# EAGLE design robot_vac (EAGLE 7.3.0)
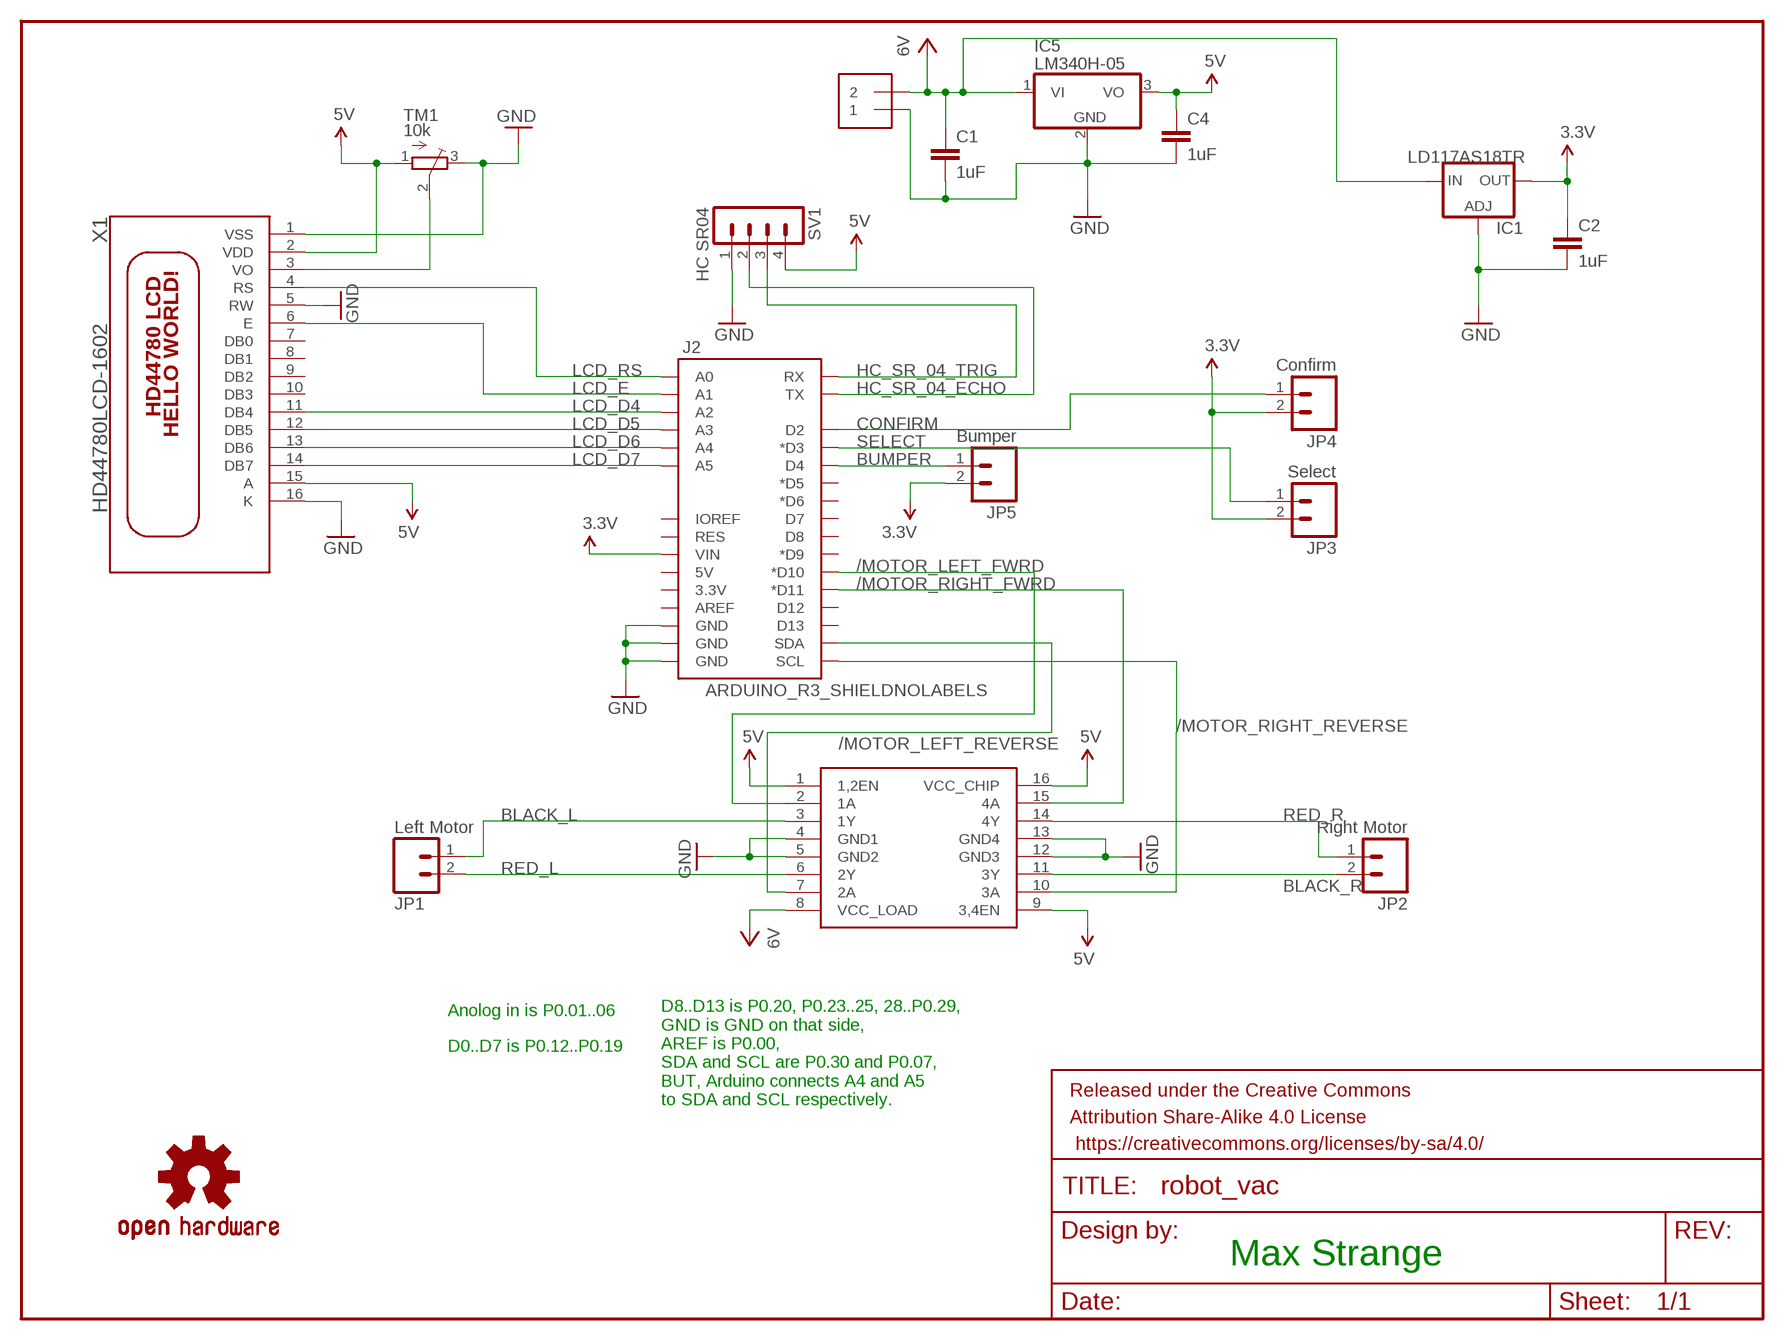
[diagram p0: schematic, sheet 1]

## Parts
C1  1uF  CAPPTH  [CAP-PTH-SMALL]
C2  1uF  CAPPTH  [CAP-PTH-SMALL]
C4  1uF  CAPPTH  [CAP-PTH-SMALL]
FRAME1  FRAME-LETTERNO_PACKAGE  [DUMMY]
H_BRIDGE  SN75441_H_BRIDGE  [DIL16]
IC1  LD117AS18TR  [SOT223]
IC5  LM340H-05  [TO220H]
J1  1X2-3.5MM  [1X2-3.5MM]
J2  ARDUINO_R3_SHIELDNOLABELS  [UNO_R3_SHIELD_NOLABELS]
JP1  Left Motor  M02LOCK  [1X02_LOCK]
JP2  Right Motor  M02LOCK  [1X02_LOCK]
JP3  Select  M02LOCK  [1X02_LOCK]
JP4  Confirm  M02LOCK  [1X02_LOCK]
JP5  Bumper  M02LOCK  [1X02_LOCK]
LOGO1  OSHW-LOGOL  [OSHW-LOGO-L]
SV1  HC SR04  MA04-1  [MA04-1]
TM1  10k  TRIMPOT3386  [TRIM-3386]
X1  HD44780LCD-1602  [LCD1602]

## Nets
3.3V [supply]: C2.1 IC1.4(OUT) J2.VIN JP3.2 JP4.2 JP5.2
5V [supply]: C4.1 H_BRIDGE.1(1,2EN) H_BRIDGE.9(3,4EN) H_BRIDGE.16(VCC_CHIP) IC5.3(VO) SV1.4 TM1.1(A) X1.2(VDD) X1.15(A)
/MOTOR_LEFT_FWRD: H_BRIDGE.2(1A) J2.D10(*D10)
/MOTOR_LEFT_REVERSE: H_BRIDGE.7(2A) J2.SDA
/MOTOR_RIGHT_FWRD: H_BRIDGE.15(4A) J2.D11(*D11)
/MOTOR_RIGHT_REVERSE: H_BRIDGE.10(3A) J2.SCL
BLACK_L: H_BRIDGE.3(1Y) JP1.1
BLACK_R: H_BRIDGE.11(3Y) JP2.2
BUMPER: J2.D4 JP5.1
CONFIRM: J2.D2 JP4.1
GND [supply]: C1.2 C2.2 C4.2 H_BRIDGE.4(GND1) H_BRIDGE.5(GND2) H_BRIDGE.12(GND3) H_BRIDGE.13(GND4) IC1.1(ADJ) IC5.2(GND) J1.1 J2.GND@0(GND) J2.GND@1(GND) J2.GND@2(GND) SV1.1 TM1.3(E) X1.1(VSS) X1.5(RW) X1.16(K)
HC_SR_04_ECHO: J2.TX SV1.2
HC_SR_04_TRIG: J2.RX SV1.3
LCD_D4: J2.A2 X1.11(DB4)
LCD_D5: J2.A3 X1.12(DB5)
LCD_D6: J2.A4 X1.13(DB6)
LCD_D7: J2.A5 X1.14(DB7)
LCD_E: J2.A1 X1.6(E)
LCD_RS: J2.A0 X1.4(RS)
N$4: TM1.2(S) X1.3(VO)
RED_L: H_BRIDGE.6(2Y) JP1.2
RED_R: H_BRIDGE.14(4Y) JP2.1
SELECT: J2.D3(*D3) JP3.1
VCC [supply]: C1.1 H_BRIDGE.8(VCC_LOAD) IC1.3(IN) IC5.1(VI) J1.2 ; supply symbol labelled 6V
Unconnected: J2.3.3V J2.5V J2.AREF J2.D5(*D5) J2.D6(*D6) J2.D7 J2.D8 J2.D9(*D9) J2.D12 J2.D13 J2.IOREF J2.RES X1.7(DB0) X1.8(DB1) X1.9(DB2) X1.10(DB3)

## Notes on the sheet
- Anolog in is P0.01..06
- D0..D7 is P0.12..P0.19
- D8..D13 is P0.20, P0.23..25, 28..P0.29,
  GND is GND on that side,
  AREF is P0.00,
  SDA and SCL are P0.30 and P0.07,
  BUT, Arduino connects A4 and A5
  to SDA and SCL respectively.
- Max Strange

## Library data of the parts
C1 C2 C4 = SparkFun-Capacitors:CAP: Capacitor Standard 0603 ceramic capacitor, and 0.1" leaded capacitor.
FRAME1 = SparkFun-Aesthetics:FRAME-LETTER: Schematic Frame Standard 8.5x11 US Letter frame; DESIGNER: Nobody; VERSION: v01
H_BRIDGE = max parts:SN75441_H_BRIDGE
IC1 = v-reg:LD117A?*: Low drop fixed and adjustable positive voltage regulators 1 A Source: http://www.st.com/stonline/products/literature/ds/7194/ld1117axx.pdf
IC5 = linear:LM340?-*: Positive VOLTAGE REGULATOR Source: http://cache.national.com/ds/LM/LM340.pdf
J1 = adafruit:1X2: 3.5mm Terminal block http://www.ladyada.net/library/pcb/eaglelibrary.html
J2 = SparkFun-Boards:ARDUINO_R3_SHIELD: Shield form compatible with the Arduino Uno R3.
JP1-JP5 = SparkFun-Connectors:M02: Standard 2-pin 0.1" header. Use with - straight break away headers ( PRT-00116) - right angle break away headers (PRT-00553) - swiss pins (PRT-00743) - machine pins (PRT-00117) - female headers (PRT-00115) Molex polarized connector foot print use with: PRT-08233 with associated crimp pins and housings. 2.54_SCREWTERM for use with PRT-10571. 3.5mm Screw Terminal footprints for PRT-08084 5mm Screw Terminal footprints for use with PRT-08432
LOGO1 = SparkFun-Aesthetics:OSHW-LOGO: Open Source Hardware Logo This logo indicates the piece of hardware it is found on incorporates a OSHW license and/or adheres to the definition of open source hardware found here: http://freedomdefined.org/OSHW
SV1 = con-lstb:MA04-1: PIN HEADER; OC_FARNELL: unknown; OC_NEWARK: unknown
TM1 = adafruit:TRIMPOT: SMT trimmer potentiometer part number TC33X http://www.ladyada.net/library/eagle
X1 = max parts:HD44780LCD: HD44780 LCD Standard character type LCDs, available in sizes from 8x1 to 40x4!

## Net classes
0 default: width 0.254 mm, clearance 0.254 mm
1 supply: width 0.508 mm, clearance 0.205 mm to class 0, clearance 0.508 mm

## Board
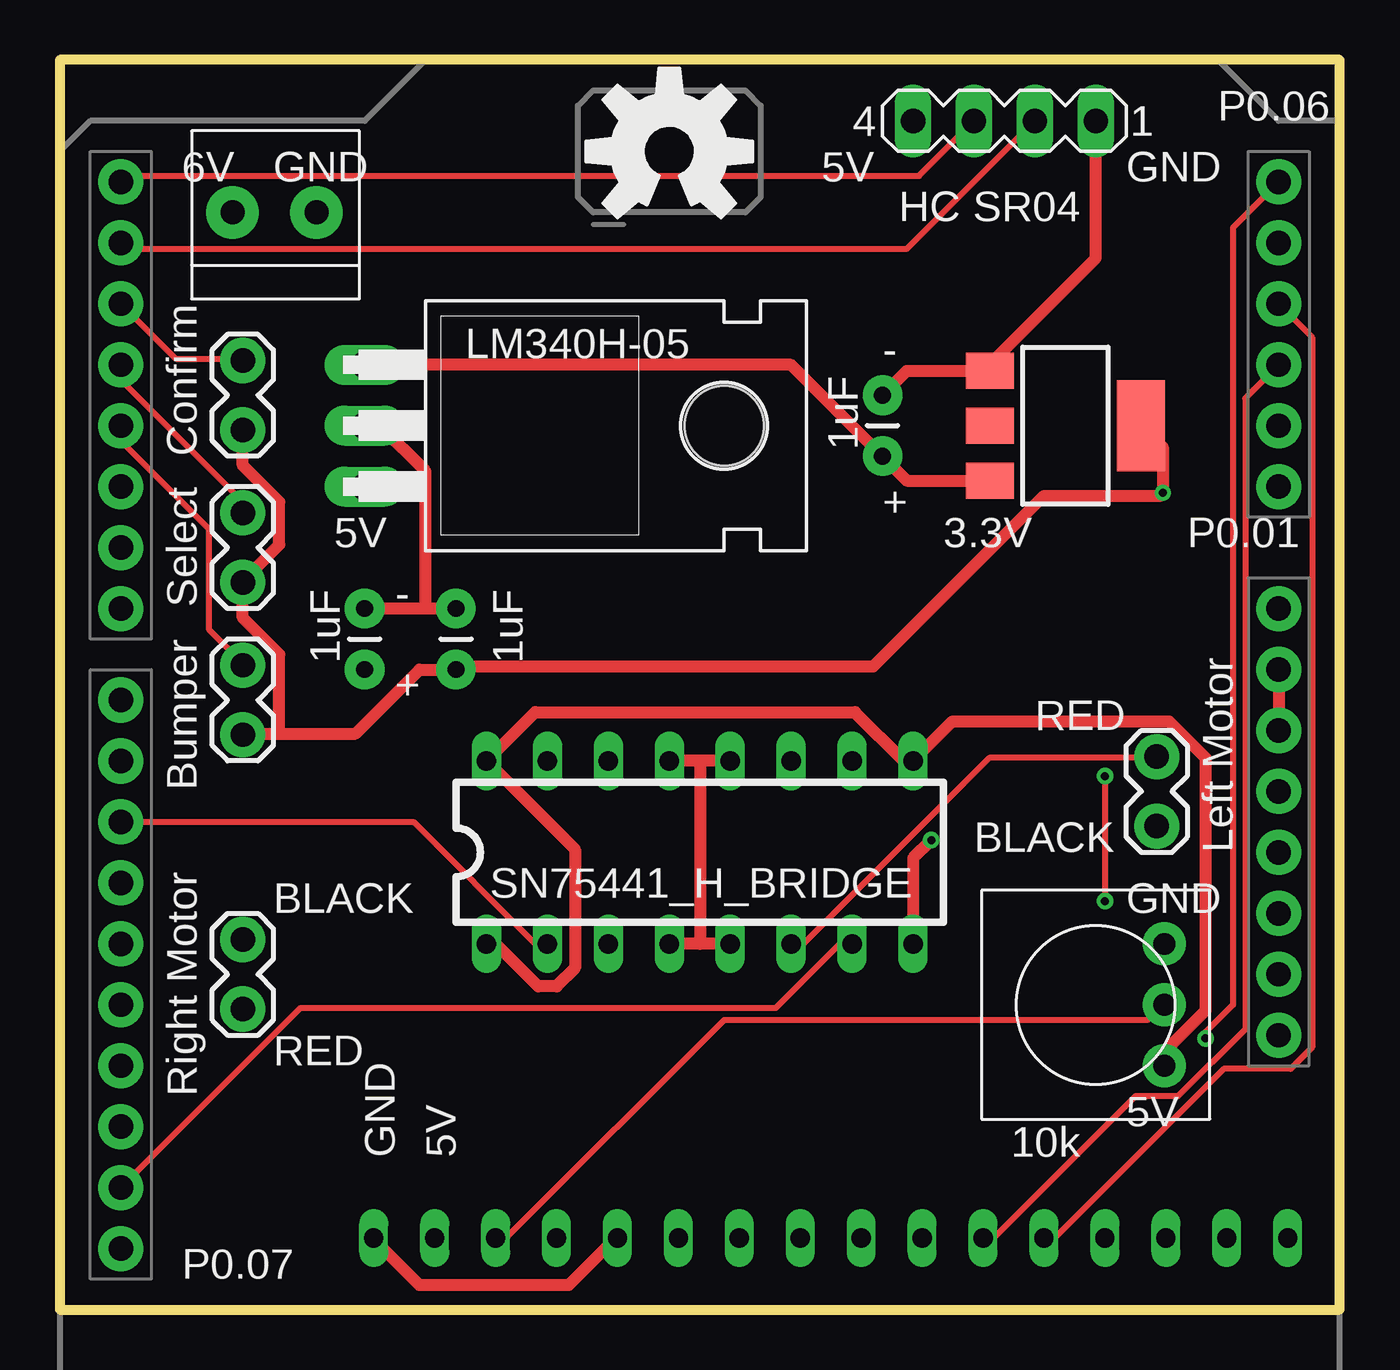
[diagram p1: board, top side]
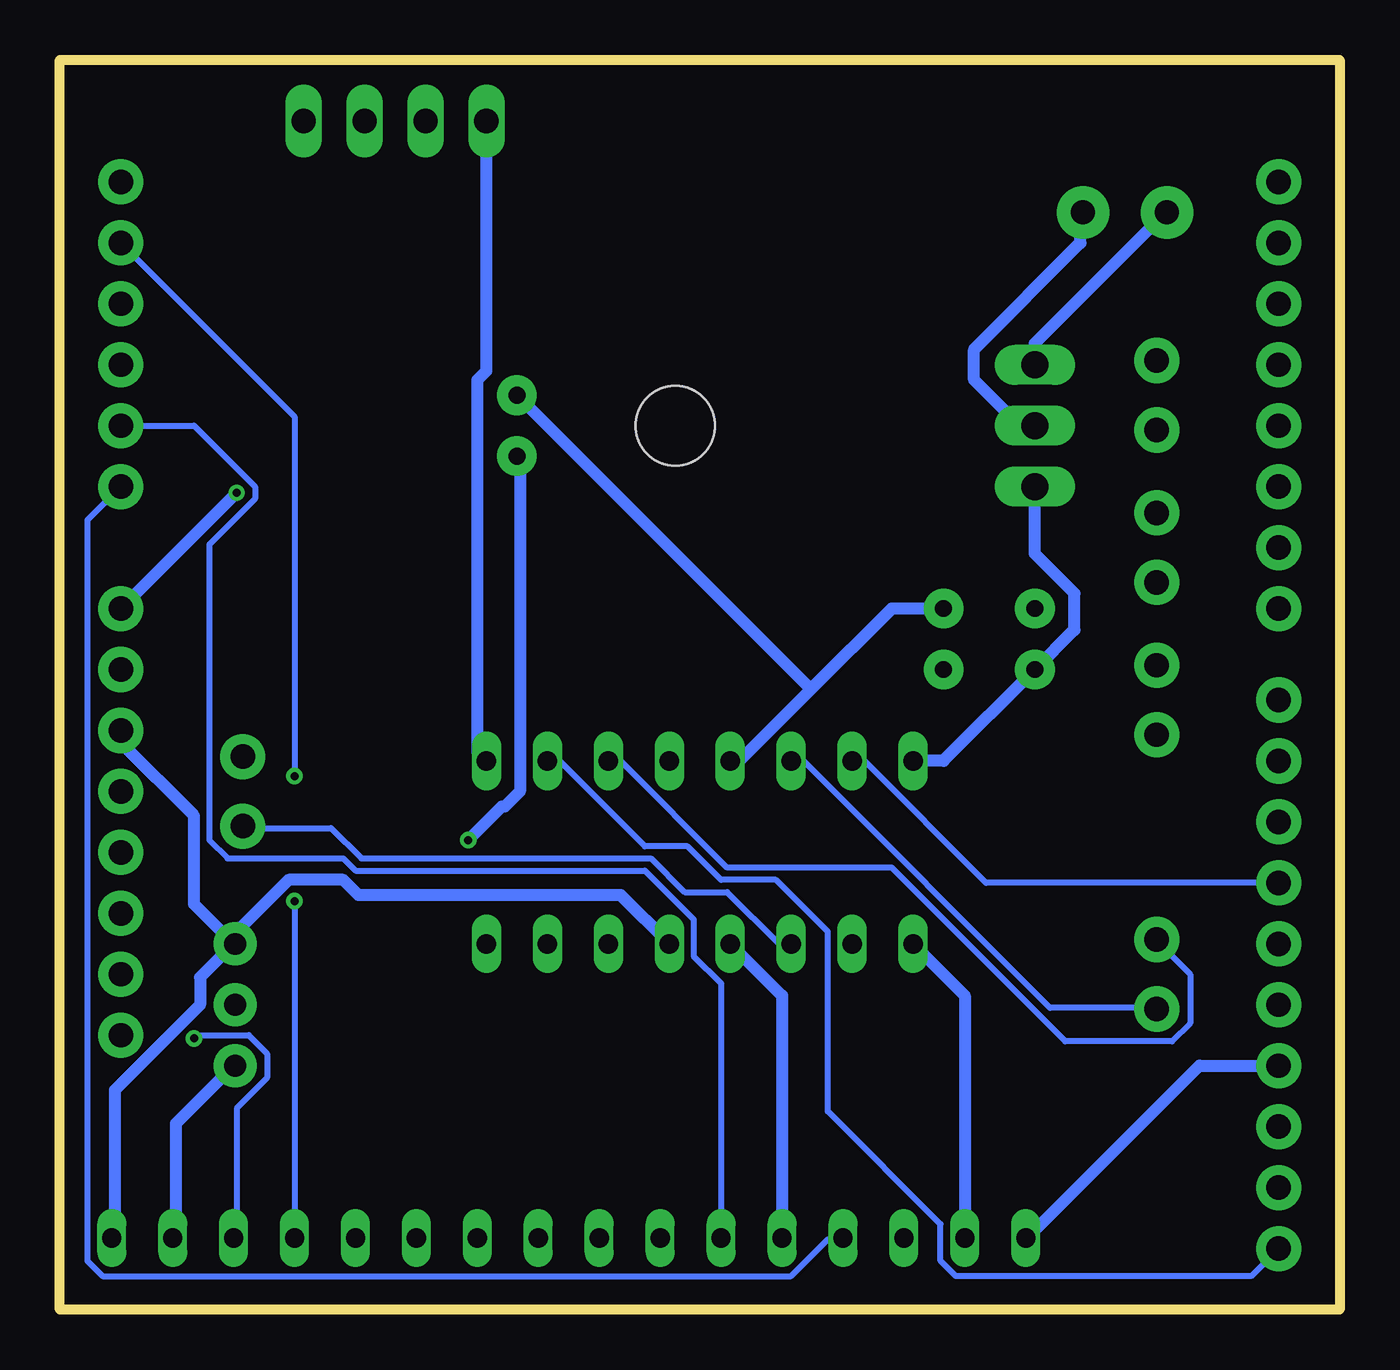
[diagram p2: board, bottom side, seen from below]

Size 53.34 x 52.07 mm. Coordinates in mm from the lower left corner, seen from the top.
Outline: 0,0 53.34,0 53.34,52.07 0,52.07 0,0
Copper layers (1*16): Top 0.0356mm / dielectric 1.5011mm / Bottom 0.0356mm
Design rules "LaenPCBOrder": minimum track width 6mil, minimum drill 13mil, track to track 6mil, track to pad 6mil, pad to pad 6mil, via to via 6mil, smd to smd 6mil, copper to edge 15mil, drill to drill 6mil, minimum pad ring 7mil, minimum via ring 7mil, stop-mask expansion 3mil, vias tented up to drill 0mil, thermal gap 10mil

### Footprints (pad centres in the part's own frame; a part is rotated, then mirrored left to right if it is on the bottom)
CAP-PTH-SMALL = drill 0.7 pad 1.651: 1 0,0; 2 2.54,0
DIL16 = drill 0.813 long: 1 -8.89,-3.81; 2 -6.35,-3.81; 3 -3.81,-3.81; 4 -1.27,-3.81; 5 1.27,-3.81; 6 3.81,-3.81; 7 6.35,-3.81; 8 8.89,-3.81; 9 8.89,3.81; 10 6.35,3.81; 11 3.81,3.81; 12 1.27,3.81; 13 -1.27,3.81; 14 -3.81,3.81; 15 -6.35,3.81; 16 -8.89,3.81
SOT223 = smd 1.5 x 2: 1 -2.3,-3.15; 2 0,-3.15; 3 2.3,-3.15 | smd 3.8 x 2: 4 0,3.15
TO220H = drill 1.118 long: 1 -2.54,-10.16; 2 0,-10.16; 3 2.54,-10.16 | hole 3.302: 0,4.826
1X2-3.5MM = drill 1 pad 2.184: 1 1.8,0; 2 -1.7,0
UNO_R3_SHIELD_NOLABELS = drill 1.016 pad 1.88: 3.3V 50.8,26.67; 5V 50.8,29.21; A0 50.8,41.91; A1 50.8,44.45; A2 50.8,46.99; A3 50.8,49.53; A4 50.8,52.07; A5 50.8,54.61; AREF 2.54,15.24; D2 2.54,49.53; D3 2.54,46.99; D4 2.54,44.45; D5 2.54,41.91; D6 2.54,39.37; D7 2.54,36.83; D8 2.54,33.02; D9 2.54,30.48; D10 2.54,27.94; D11 2.54,25.4; D12 2.54,22.86; D13 2.54,20.32; GND@0 50.8,31.75; GND@1 50.8,34.29; GND@2 2.54,17.78; IOREF 50.8,21.59; NC 50.8,19.05; RES 50.8,24.13; RX 2.54,54.61; SCL 2.54,10.16; SDA 2.54,12.7; TX 2.54,52.07; VIN 50.8,36.83
1X02_LOCK = drill 1.016 pad 1.88: 1 -0.178,0; 2 2.718,0
MA04-1 = drill 1.016 long: 1 -3.81,0; 2 -1.27,0; 3 1.27,0; 4 3.81,0
TRIM-3386 = drill 0.9 pad 1.778: 1 -2.54,-2.857; 2 0,-2.857; 3 2.54,-2.857
LCD1602 = drill 0.8 long: 1 8,2.98; 2 10.54,2.98; 3 13.08,2.98; 4 15.62,2.98; 5 18.16,2.98; 6 20.7,2.98; 7 23.24,2.98; 8 25.78,2.98; 9 28.32,2.98; 10 30.86,2.98; 11 33.4,2.98; 12 35.94,2.98; 13 38.48,2.98; 14 41.02,2.98; 15 43.56,2.98; 16 46.1,2.98

### Placement (x,y rotation side)
C1  34.29,35.56 90 top
C2  16.51,26.67 90 top
C4  12.7,26.67 90 top
FRAME1  -22.86,10.16 0 top  (outside the outline)
H_BRIDGE  26.67,19.05 0 top
IC1  41.91,36.83 270 top
IC5  22.86,36.83 270 top
J1  8.89,45.72 0 top
J2  0,-7.62 0 top
JP1  45.72,20.32 90 top
JP2  7.62,12.7 90 top
JP3  7.62,33.02 270 top
JP4  7.62,39.37 270 top
JP5  7.62,26.67 270 top
LOGO1  25.4,48.26 0 top
SV1  39.37,49.53 180 top
TM1  43.18,12.7 90 top
X1  5.08,0 0 top

### Tracks (layer width: path | path; a pad name or v marks a point on that pad's centre or on a via)
3.3V  (via drill 0.33)
  Top 0.508: IC1.4 45.09,36.83 45.97,35.94 v45.97,34.04 45.85,33.91 41.02,33.91 33.91,26.8 16.64,26.8 C2.1 14.99,26.67 12.32,24 9.14,24 | 9.14,24 7.62,24 JP5.2 | 9.14,24 9.14,27.3 7.62,28.83 JP3.2 7.75,30.48 9.14,31.88 9.14,33.66 7.62,35.18 JP4.2
  Bottom 0.508: v45.97,34.04 J2.VIN
5V
  Top 0.508: TM1.1 46.1,10.16 46.1,10.79 47.75,12.45 47.75,22.99 46.23,24.51 37.21,24.51 H_BRIDGE.9 35.18,22.86 33.15,24.89 19.81,24.89 H_BRIDGE.16 21.46,19.18 21.46,14.22 20.7,13.46 19.94,13.46 18.16,15.24 H_BRIDGE.1
  Bottom 0.508: H_BRIDGE.1 15.62,13.08 15.62,3.05 X1.2 | X1.15 48.51,3.05 48.51,7.75 46.1,10.16 TM1.1 | H_BRIDGE.16 16.51,22.86 C4.1 11.05,28.32 11.05,29.85 12.7,31.5 IC5.3 | SV1.4 35.56,39.12 35.94,38.73 35.94,23.24 H_BRIDGE.9
/MOTOR_LEFT_FWRD
  Top 0.254: H_BRIDGE.2 19.81,15.24 14.73,20.32 J2.D10
/MOTOR_LEFT_REVERSE
  Top 0.254: H_BRIDGE.7 32.51,15.24 29.84,12.57 10.03,12.57 J2.SDA
/MOTOR_RIGHT_FWRD
  Bottom 0.254: H_BRIDGE.15 19.81,22.86 14.73,17.78 J2.D11
/MOTOR_RIGHT_REVERSE
  Bottom 0.254: H_BRIDGE.10 32.51,22.86 28.96,19.3 27.18,19.3 25.78,17.91 23.5,17.91 21.34,15.75 21.34,8.25 16.64,3.56 16.64,2.03 16,1.4 3.68,1.4 J2.SCL
BLACK_L
  Bottom 0.254: H_BRIDGE.3 23.37,15.24 25.53,17.4 27.3,17.4 28.7,18.8 40.77,18.8 42.04,20.07 45.72,20.07 JP1.1
BLACK_R
  Bottom 0.254: H_BRIDGE.11 29.97,22.86 25.53,18.41 18.67,18.41 11.43,11.18 6.99,11.18 6.22,11.94 6.22,13.97 7.62,15.37 JP2.2
BUMPER
  Top 0.254: J2.D4 2.54,36.2 6.22,32.51 6.22,28.32 7.62,26.92 JP5.1
CONFIRM
  Top 0.254: J2.D2 4.83,39.62 7.62,39.62 JP4.1
GND
  Top 0.508: J2.GND@1 J2.GND@0 | X1.1 13.08,2.92 14.99,1.02 21.21,1.02 23.11,2.92 X1.5 | C1.2 35.31,39.12 38.73,39.12 IC1.1 38.73,39.37 43.18,43.82 SV1.1 | H_BRIDGE.5 26.67,15.24 | 26.67,15.24 H_BRIDGE.4 | H_BRIDGE.12 26.67,22.86 | 26.67,22.86 H_BRIDGE.13 | 26.67,22.86 26.67,15.24 | C2.2 15.24,29.21 | 15.24,29.21 C4.2 | IC5.2 13.34,36.83 15.24,34.93 15.24,29.21
  Bottom 0.508: X1.16 51.05,3.05 51.05,9.14 47.5,12.7 47.5,13.84 46.1,15.24 TM1.3 | J2.GND@0 50.8,23.62 47.75,20.57 47.75,16.89 46.23,15.37 TM1.3 | J2.GND@2 5.84,10.16 12.95,3.05 X1.1 | IC5.2 13.34,36.83 15.24,38.73 15.24,40.01 10.79,44.45 10.79,45.72 J1.1 | H_BRIDGE.13 25.02,22.86 22.04,25.85 | 22.04,25.85 18.67,29.21 C2.2 | 22.04,25.85 C1.2 | H_BRIDGE.4 23.24,13.08 23.24,3.05 X1.5 | H_BRIDGE.5 29.97,17.27 40.89,17.27 41.53,17.91 43.81,17.91 45.97,15.75 45.97,15.49 TM1.3
HC_SR_04_ECHO
  Top 0.254: SV1.2 35.31,44.2 2.79,44.2 J2.TX
HC_SR_04_TRIG
  Top 0.254: SV1.3 35.81,47.24 2.79,47.24 J2.RX
LCD_D4
  Top 0.254: J2.A2 49.4,37.97 49.4,11.68 46.61,8.89 44.83,8.89 38.99,3.05 38.48,3.05 X1.11
LCD_D5
  Top 0.254: J2.A3 52.2,40.51 52.2,10.92 51.31,10.03 48.51,10.03 41.53,3.05 41.02,3.05 X1.12
LCD_D6  (via drill 0.33)
  Top 0.254: v43.56,22.22 v43.56,17.02
  Bottom 0.254: v43.56,17.02 43.56,3.05 X1.13 | v43.56,22.22 43.56,37.21 J2.A4
LCD_D7  (via drill 0.33)
  Top 0.254: v47.75,11.3 47.75,11.56 48.9,12.7 48.9,45.09 J2.A5
  Bottom 0.254: v47.75,11.3 47.62,11.43 45.47,11.43 44.7,10.67 44.7,9.65 45.97,8.38 45.97,3.05 X1.14
LCD_E
  Bottom 0.254: J2.A1 47.75,36.83 45.21,34.29 45.21,33.78 47.12,31.88 47.12,19.56 46.35,18.8 41.53,18.8 41.02,18.29 28.96,18.29 26.92,16.26 26.92,14.73 25.78,13.59 25.78,3.05 X1.6
LCD_RS
  Bottom 0.254: J2.A0 52.2,32.89 52.2,2.03 51.56,1.4 22.86,1.4 21.34,2.92 20.7,2.92 X1.4
N$4
  Top 0.254: X1.3 18.16,3.05 18.67,3.05 27.69,12.06 45.34,12.06 45.97,12.7 TM1.2
RED_L
  Top 0.254: H_BRIDGE.6 30.99,15.24 38.73,22.99 45.72,22.99 JP1.2
RED_R
  Bottom 0.254: H_BRIDGE.14 22.35,22.86 12.06,12.57 7.62,12.57 JP2.1
SELECT
  Top 0.254: J2.D3 2.54,38.73 7.62,33.66 JP3.1
VCC  (via drill 0.33)
  Top 0.508: IC1.3 38.73,34.54 35.31,34.54 C1.1 30.48,39.37 IC5.1 | H_BRIDGE.8 35.56,18.8 v36.32,19.56
  Bottom 0.508: IC5.1 12.7,40.26 7.24,45.72 J1.2 | v36.32,19.56 34.92,20.95 34.8,20.95 34.16,21.59 34.16,35.43 C1.1

### Text on the board
tPlace: P0.06 | 6V | GND | 5V | GND | - | + | 5V | 3.3V | P0.01 | - | + | RED | BLACK | BLACK | GND | RED | 5V | GND | 5V | P0.07